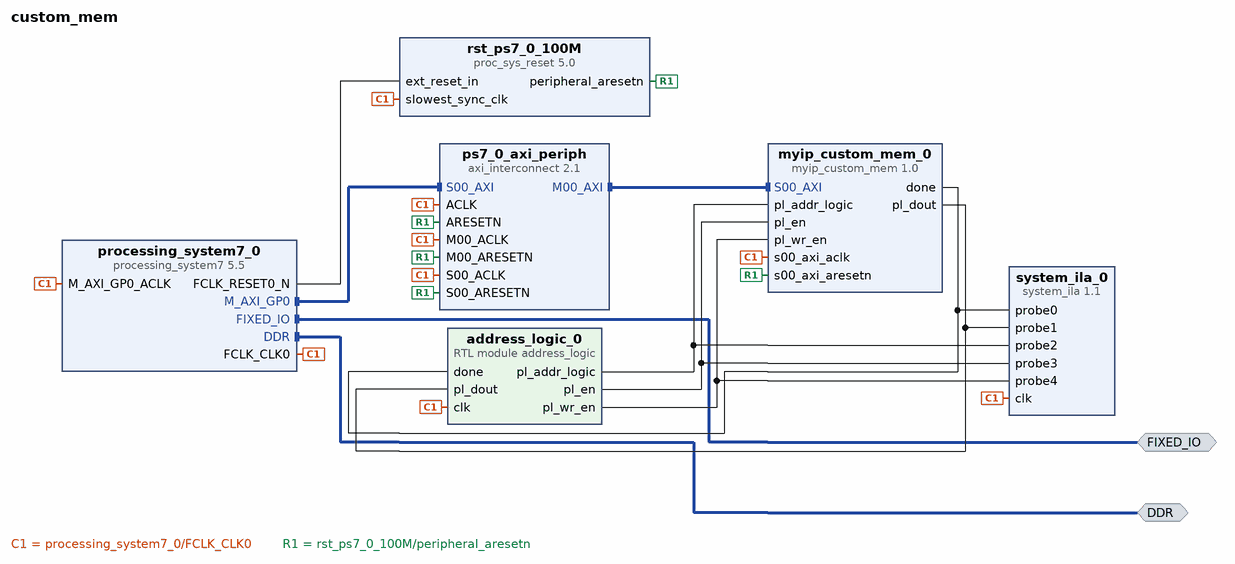
[diagram p0: block diagram of the top level]
# Vivado block design custom_mem, xc7z020clg484-1, Vivado 2019.1
create_bd_design custom_mem

create_bd_intf_port -mode Master -vlnv xilinx.com:interface:ddrx_rtl:1.0 DDR
create_bd_intf_port -mode Master -vlnv xilinx.com:display_processing_system7:fixedio_rtl:1.0 FIXED_IO

create_bd_cell -type ip -vlnv xilinx.com:ip:processing_system7:5.5 processing_system7_0
set_property -dict [list \
  CONFIG.PCW_APU_PERIPHERAL_FREQMHZ 666.666667 \
  CONFIG.PCW_ENET0_ENET0_IO {MIO 16 .. 27} \
  CONFIG.PCW_ENET0_GRP_MDIO_ENABLE 1 \
  CONFIG.PCW_ENET0_GRP_MDIO_IO {MIO 52 .. 53} \
  CONFIG.PCW_ENET0_PERIPHERAL_ENABLE 1 \
  CONFIG.PCW_FPGA0_PERIPHERAL_FREQMHZ 100.000000 \
  CONFIG.PCW_FPGA1_PERIPHERAL_FREQMHZ 150.000000 \
  CONFIG.PCW_FPGA2_PERIPHERAL_FREQMHZ 50.000000 \
  CONFIG.PCW_GPIO_MIO_GPIO_ENABLE 0 \
  CONFIG.PCW_PRESET_BANK1_VOLTAGE {LVCMOS 1.8V} \
  CONFIG.PCW_QSPI_PERIPHERAL_ENABLE 0 \
  CONFIG.PCW_SD0_PERIPHERAL_ENABLE 0 \
  CONFIG.PCW_SDIO_PERIPHERAL_FREQMHZ 50 \
  CONFIG.PCW_UART1_PERIPHERAL_ENABLE 1 \
  CONFIG.PCW_UART1_UART1_IO {MIO 48 .. 49} \
  CONFIG.PCW_UART_PERIPHERAL_FREQMHZ 50 \
  CONFIG.PCW_UIPARAM_DDR_FREQ_MHZ 533.333313 \
  CONFIG.PCW_UIPARAM_DDR_PARTNO {MT41J128M16 HA-15E} \
  CONFIG.PCW_USB0_PERIPHERAL_ENABLE 0 \
  CONFIG.preset ZedBoard \
] [get_bd_cells processing_system7_0]
# 113 more settings of processing_system7_0 are not shown: defaults, MIO pin electricals, DDR timing, and values the tool derives
create_bd_cell -type ip -vlnv user.org:user:myip_custom_mem:1.0 myip_custom_mem_0
create_bd_cell -type ip -vlnv xilinx.com:ip:axi_interconnect:2.1 ps7_0_axi_periph
set_property -dict {CONFIG.NUM_MI 1} [get_bd_cells ps7_0_axi_periph]
create_bd_cell -type ip -vlnv xilinx.com:ip:proc_sys_reset:5.0 rst_ps7_0_100M
create_bd_cell -type module -reference address_logic address_logic_0
create_bd_cell -type ip -vlnv xilinx.com:ip:system_ila:1.1 system_ila_0
set_property -dict [list \
  CONFIG.C_MON_TYPE NATIVE \
  CONFIG.C_NUM_OF_PROBES 5 \
  CONFIG.C_PROBE0_TYPE 0 \
  CONFIG.C_PROBE1_TYPE 0 \
  CONFIG.C_PROBE2_TYPE 0 \
  CONFIG.C_PROBE3_TYPE 0 \
  CONFIG.C_PROBE4_TYPE 0 \
] [get_bd_cells system_ila_0]

# ---- connections ----

connect_bd_intf_net [get_bd_intf_pins ps7_0_axi_periph/M00_AXI] [get_bd_intf_pins myip_custom_mem_0/S00_AXI]
connect_bd_intf_net [get_bd_intf_pins processing_system7_0/M_AXI_GP0] [get_bd_intf_pins ps7_0_axi_periph/S00_AXI]
connect_bd_intf_net [get_bd_intf_ports FIXED_IO] [get_bd_intf_pins processing_system7_0/FIXED_IO]
connect_bd_intf_net [get_bd_intf_ports DDR] [get_bd_intf_pins processing_system7_0/DDR]
connect_bd_net [get_bd_pins processing_system7_0/FCLK_CLK0] \
  [get_bd_pins processing_system7_0/M_AXI_GP0_ACLK] [get_bd_pins ps7_0_axi_periph/S00_ACLK] \
  [get_bd_pins rst_ps7_0_100M/slowest_sync_clk] [get_bd_pins myip_custom_mem_0/s00_axi_aclk] \
  [get_bd_pins ps7_0_axi_periph/M00_ACLK] [get_bd_pins ps7_0_axi_periph/ACLK] [get_bd_pins address_logic_0/clk] \
  [get_bd_pins system_ila_0/clk]
connect_bd_net [get_bd_pins processing_system7_0/FCLK_RESET0_N] [get_bd_pins rst_ps7_0_100M/ext_reset_in]
connect_bd_net [get_bd_pins rst_ps7_0_100M/peripheral_aresetn] \
  [get_bd_pins ps7_0_axi_periph/S00_ARESETN] [get_bd_pins myip_custom_mem_0/s00_axi_aresetn] \
  [get_bd_pins ps7_0_axi_periph/M00_ARESETN] [get_bd_pins ps7_0_axi_periph/ARESETN]
connect_bd_net -net myip_custom_mem_0_done [get_bd_pins myip_custom_mem_0/done] [get_bd_pins address_logic_0/done] [get_bd_pins system_ila_0/probe0]
connect_bd_net -net myip_custom_mem_0_pl_dout [get_bd_pins myip_custom_mem_0/pl_dout] \
  [get_bd_pins address_logic_0/pl_dout] [get_bd_pins system_ila_0/probe1]
connect_bd_net -net address_logic_0_pl_addr_logic [get_bd_pins address_logic_0/pl_addr_logic] \
  [get_bd_pins myip_custom_mem_0/pl_addr_logic] [get_bd_pins system_ila_0/probe2]
connect_bd_net -net address_logic_0_pl_en [get_bd_pins address_logic_0/pl_en] [get_bd_pins myip_custom_mem_0/pl_en] [get_bd_pins system_ila_0/probe3]
connect_bd_net -net address_logic_0_pl_wr_en [get_bd_pins address_logic_0/pl_wr_en] \
  [get_bd_pins myip_custom_mem_0/pl_wr_en] [get_bd_pins system_ila_0/probe4]
set_property HDL_ATTRIBUTE.DEBUG true [get_bd_nets myip_custom_mem_0_done]
set_property HDL_ATTRIBUTE.MARK_DEBUG true [get_bd_nets myip_custom_mem_0_done]
set_property HDL_ATTRIBUTE.DEBUG true [get_bd_nets myip_custom_mem_0_pl_dout]
set_property HDL_ATTRIBUTE.MARK_DEBUG true [get_bd_nets myip_custom_mem_0_pl_dout]
set_property HDL_ATTRIBUTE.DEBUG true [get_bd_nets address_logic_0_pl_addr_logic]
set_property HDL_ATTRIBUTE.MARK_DEBUG true [get_bd_nets address_logic_0_pl_addr_logic]
set_property HDL_ATTRIBUTE.DEBUG true [get_bd_nets address_logic_0_pl_en]
set_property HDL_ATTRIBUTE.MARK_DEBUG true [get_bd_nets address_logic_0_pl_en]
set_property HDL_ATTRIBUTE.DEBUG true [get_bd_nets address_logic_0_pl_wr_en]
set_property HDL_ATTRIBUTE.MARK_DEBUG true [get_bd_nets address_logic_0_pl_wr_en]

# ---- address map ----
assign_bd_address -offset 0x43C00000 -range 64K -target_address_space [get_bd_addr_spaces processing_system7_0/Data] [get_bd_addr_segs myip_custom_mem_0/S00_AXI/S00_AXI_reg]

validate_bd_design
save_bd_design
